# EasyEDA schematic SCH_VEXSwitch_2024-01-02.json
TITLE: Sheet_1; REV: 1.0; Date: 2023-12-27; Sheet: 1/1; Drawn By: questionableapple; Company: Your Company
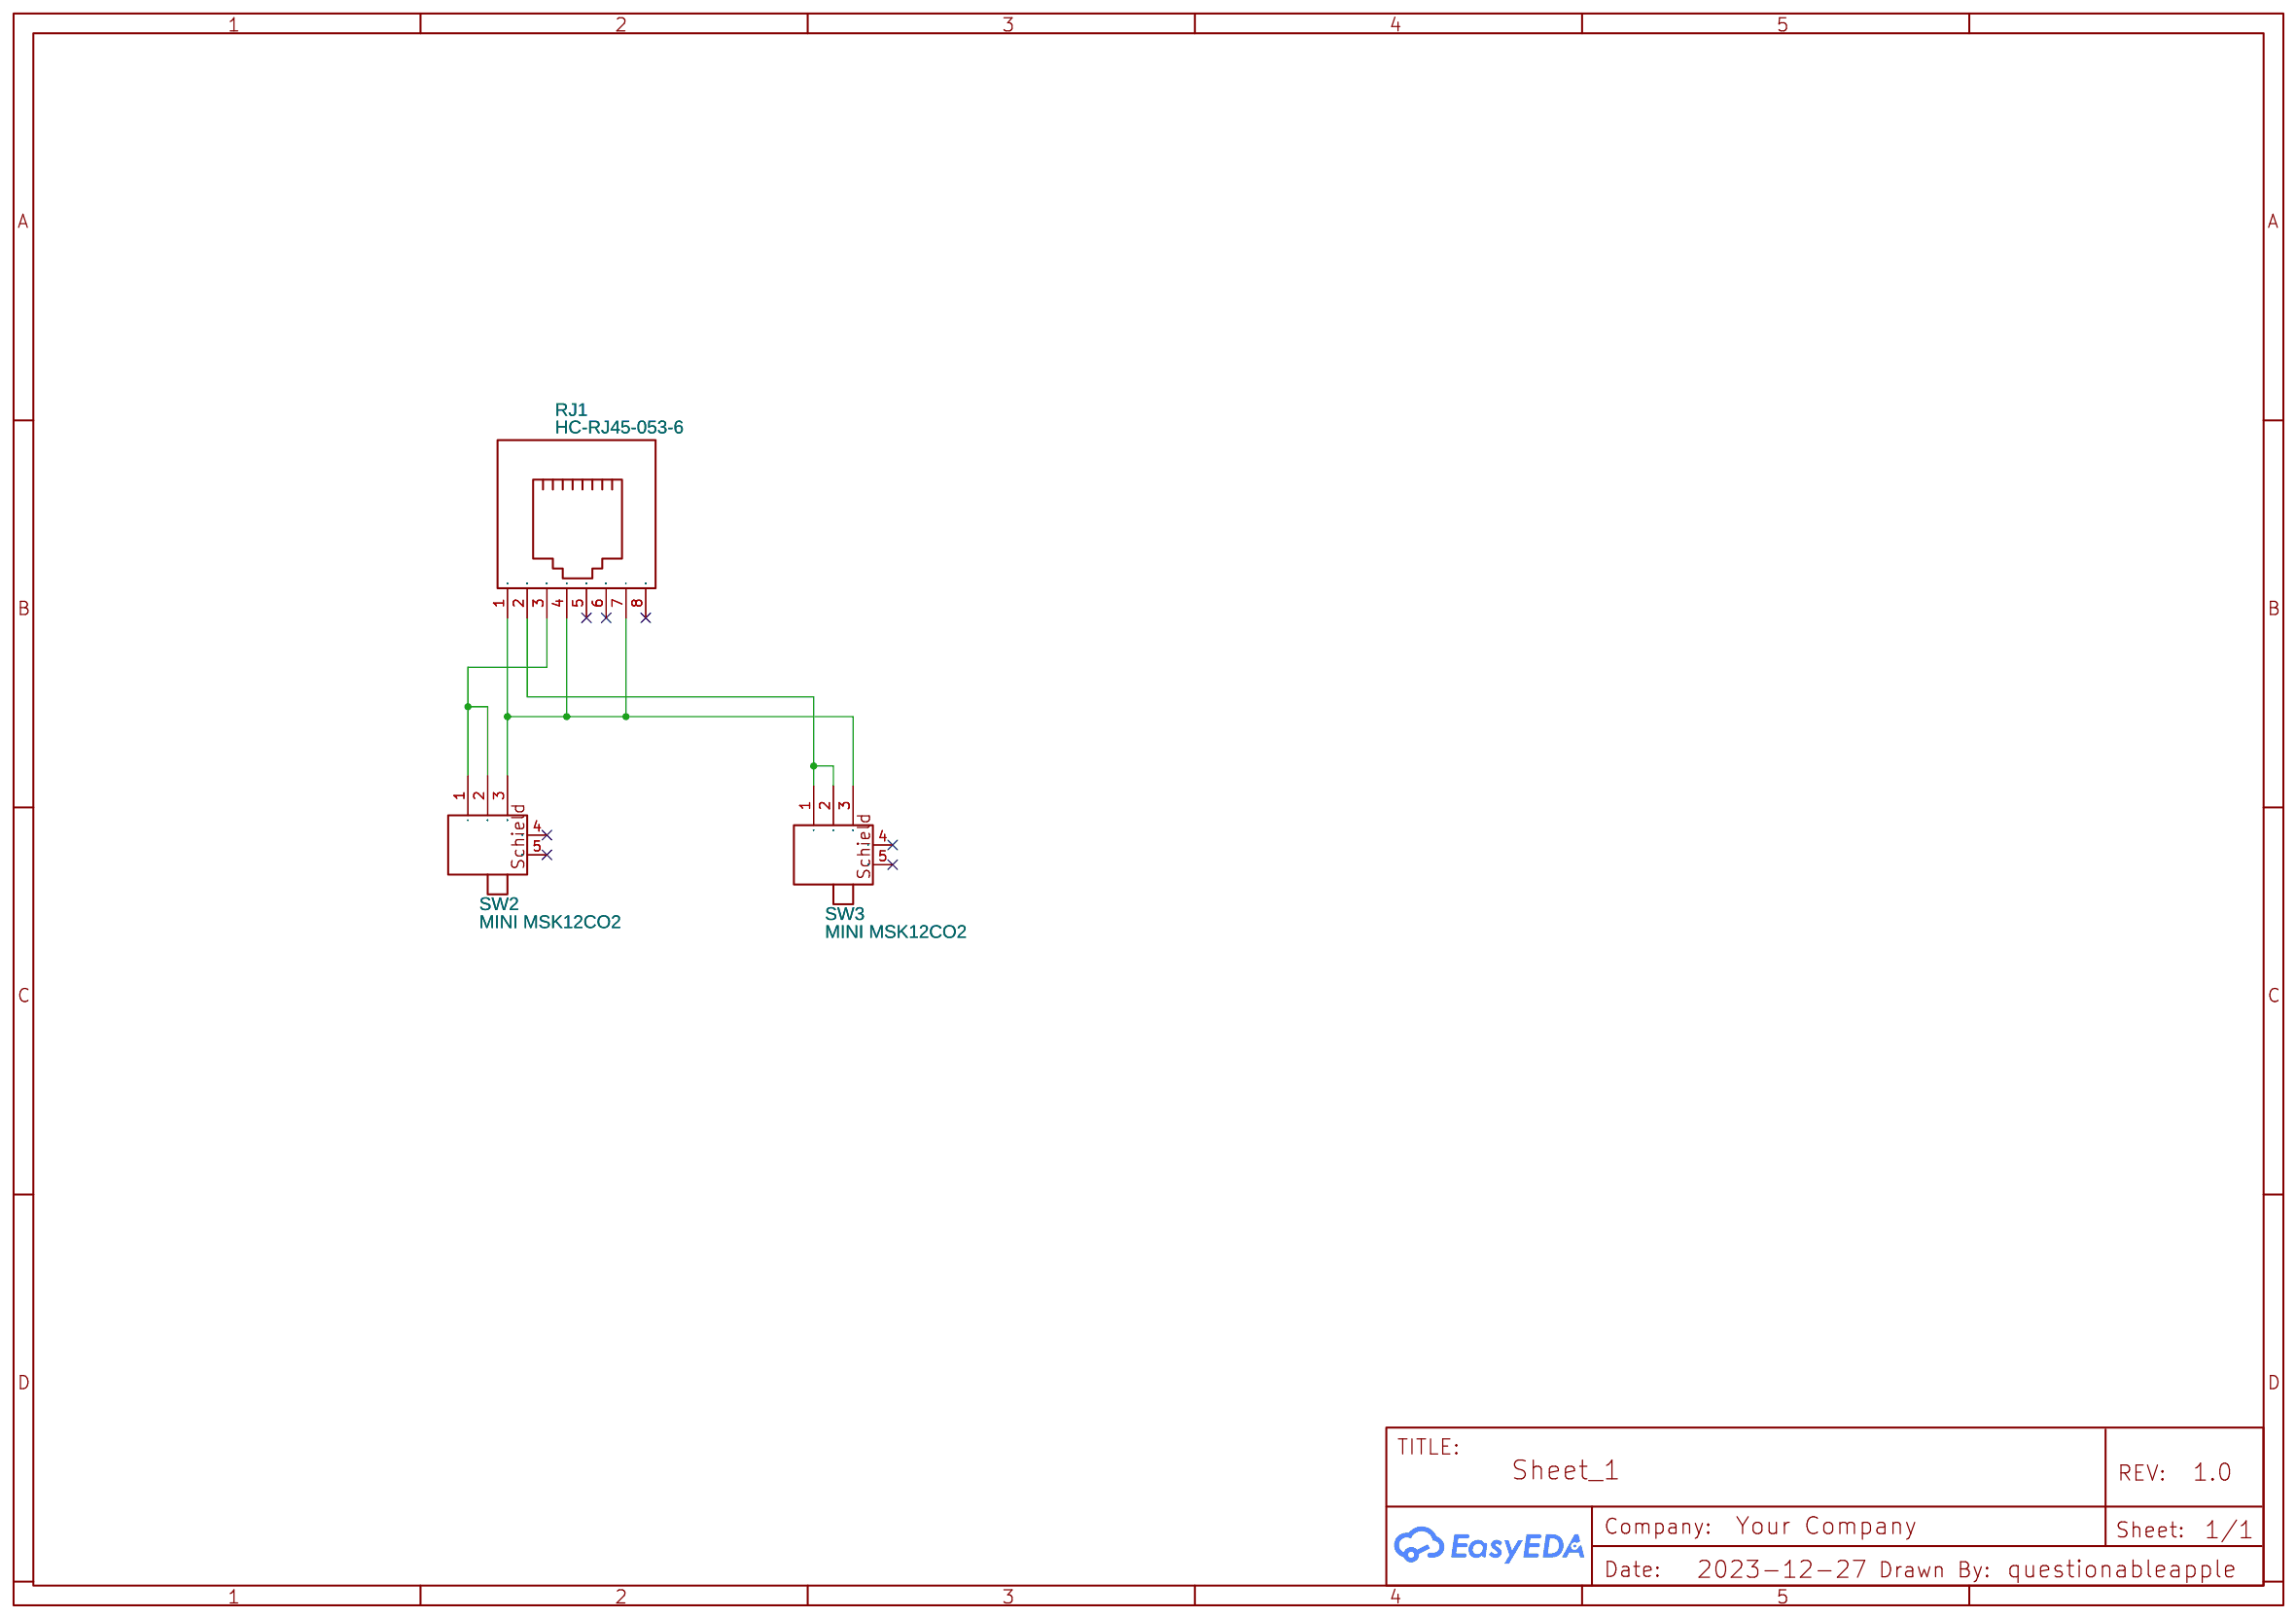
[diagram p0: schematic sheet]

## Parts
RJ1  HC-RJ45-053-6  [RJ45-TH_HC-RJ45-053-6]
SW2  MINI MSK12CO2  [SW-SMD_MSK12CO2]
SW3  MINI MSK12CO2  [SW-SMD_MSK12CO2]

## Library data of the parts
RJ1 = HC-RJ45-053-6: Supplier: LCSC; Supplier Part: C3000216; Manufacturer: HCTL(华灿天禄); Contributor: lcsc; JLCPCB Part Class: Extended Part
SW2 SW3 = MINI MSK12CO2: Contributor: LCSC; Supplier: LCSC; Supplier Part: C2681570; Manufacturer: SHOU HAN(首韩); JLCPCB Part Class: Extended Part

## Nets
Net-(RJ1-1): RJ1.1 RJ1.4 RJ1.7 SW2.3 SW3.3
Net-(RJ1-2): RJ1.2 SW3.1 SW3.2
Net-(RJ1-3): RJ1.3 SW2.1 SW2.2

Not connected (* = marked no-connect by the designer): RJ1 5* 6* 8*; SW2 4* 5*; SW3 4* 5*
